# EAGLE design Connector Board rev2 (EAGLE 9.6.2)

## Sheet 1 of 3
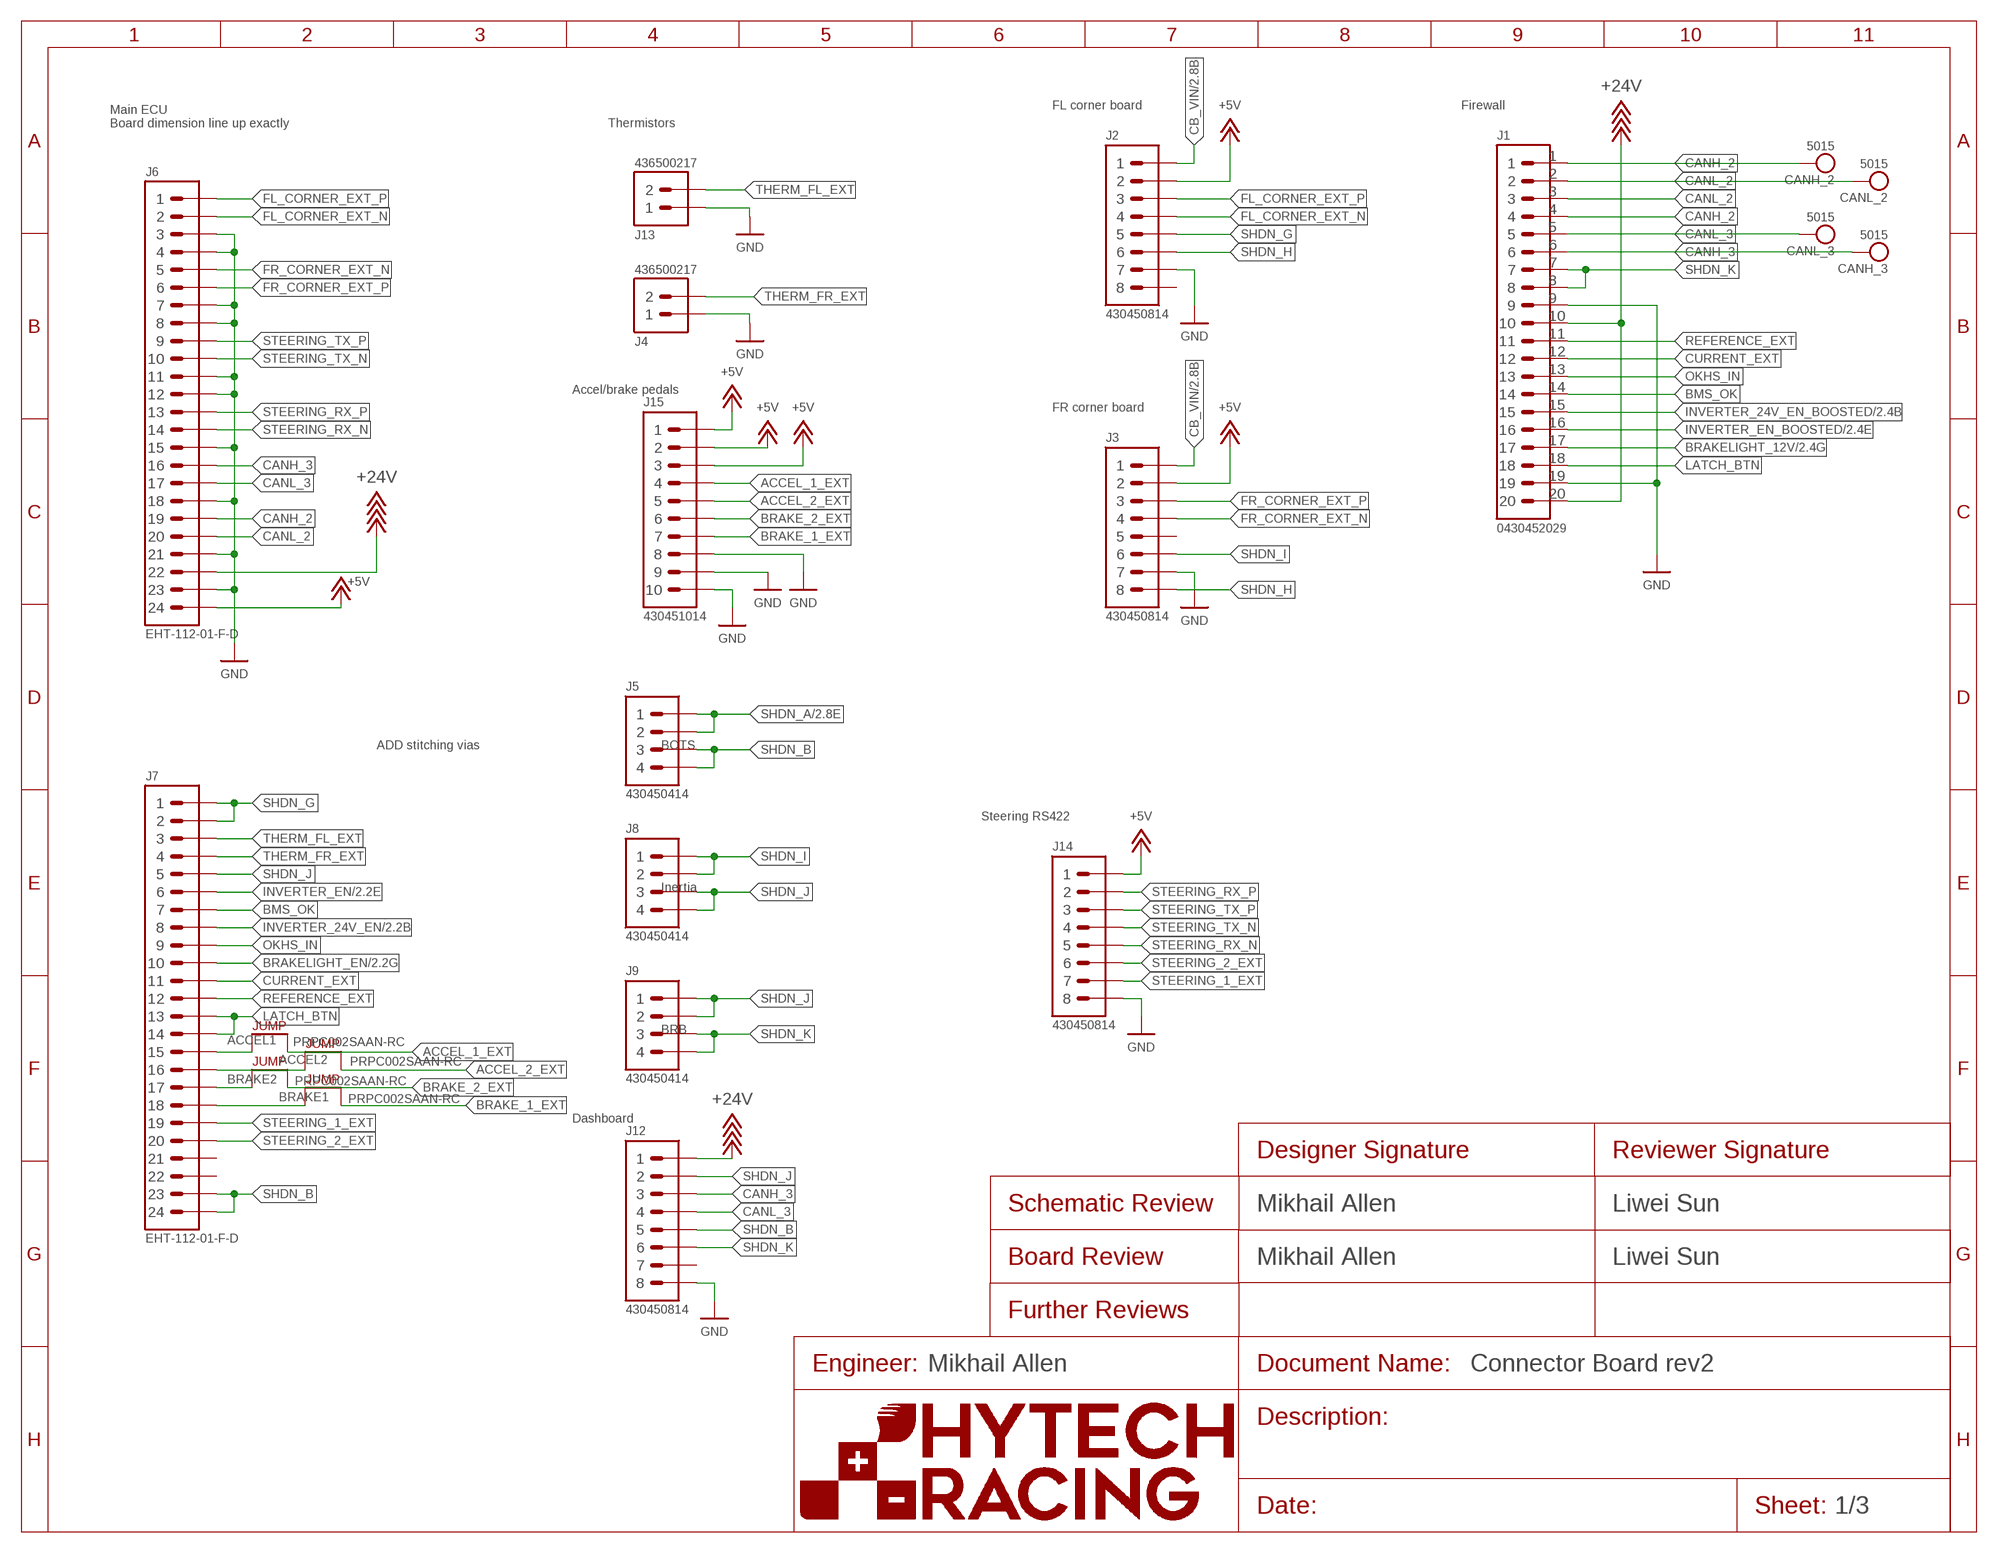
[diagram p0: schematic, sheet 1]
FRAME1 (FRAME): DESIGNER_BOARD: Mikhail Allen; DESIGNER_SCHEMATIC: Mikhail Allen; ENGINEER: Mikhail Allen; REVIEWER_BOARD: Liwei Sun; REVIEWER_SCHEMATIC: Liwei Sun

### Parts
ACCEL1  JUMPER__1X02  [1X02]
ACCEL2  JUMPER__1X02  [1X02]
BRAKE1  JUMPER__1X02  [1X02]
BRAKE2  JUMPER__1X02  [1X02]
CANH_2  TEST_POINT  [5015]
CANH_3  TEST_POINT  [5015]
CANL_2  TEST_POINT  [5015]
CANL_3  TEST_POINT  [5015]
J1  CONNECTOR-20_MF_T_V_  [MOLEX_MICROFIT_PTH_VERTICAL_20_DUAL]
J2  CONNECTOR-8_μF_T_V_BLACK  [MOLEX_MICROFIT_PTH_VERTICAL_08_DUAL]
J3  CONNECTOR-8_μF_T_V_BLACK  [MOLEX_MICROFIT_PTH_VERTICAL_08_DUAL]
J4  CONNECTOR-2_MF_T_V_  [MOLEX_MICROFIT_PTH_VERTICAL_02_SINGLE]
J5  CONNECTOR-4_μF_T_V_BLACK  [MOLEX_MICROFIT_PTH_VERTICAL_04_DUAL]
J6  CONNECTOR-24_CONNECTOR-24_  [EHT-112-01]
J7  CONNECTOR-24_CONNECTOR-24_  [EHT-112-01]
J8  CONNECTOR-4_μF_T_V_BLACK  [MOLEX_MICROFIT_PTH_VERTICAL_04_DUAL]
J9  CONNECTOR-4_μF_T_V_BLACK  [MOLEX_MICROFIT_PTH_VERTICAL_04_DUAL]
J12  CONNECTOR-8_μF_T_V_BLACK  [MOLEX_MICROFIT_PTH_VERTICAL_08_DUAL]
J13  CONNECTOR-2_MF_T_V_  [MOLEX_MICROFIT_PTH_VERTICAL_02_SINGLE]
J14  CONNECTOR-8_μF_T_V_BLACK  [MOLEX_MICROFIT_PTH_VERTICAL_08_DUAL]
J15  CONNECTOR-10_MF_T_V_  [MOLEX_MICROFIT_PTH_VERTICAL_10_DUAL]

### Nets
+5V: J2.2 J3.2 J6.24 J14.1 J15.1 J15.2 J15.3
+24V: J1.10 J1.20 J6.22 J12.1 ; also sheet 2
ACCEL_1_EXT: ACCEL1.2 J15.4
ACCEL_2_EXT: ACCEL2.2 J15.5
BMS_OK: J1.14 J7.7
BRAKE_1_EXT: BRAKE1.2 J15.7
BRAKE_2_EXT: BRAKE2.2 J15.6
BRAKELIGHT_12V: J1.17 ; also sheet 2
BRAKELIGHT_EN: J7.10 ; also sheet 2
CANH_2: CANH_2.1 J1.1 J1.4 J6.19
CANH_3: CANH_3.1 J1.6 J6.16 J12.3
CANL_2: CANL_2.1 J1.2 J1.3 J6.20
CANL_3: CANL_3.1 J1.5 J6.17 J12.4
CB_VIN: J2.1 J3.1 ; also sheet 2
CURRENT_EXT: J1.12 J7.11
FL_CORNER_EXT_N: J2.4 J6.2
FL_CORNER_EXT_P: J2.3 J6.1
FR_CORNER_EXT_N: J3.4 J6.5
FR_CORNER_EXT_P: J3.3 J6.6
GND: J1.9 J1.19 J2.7 J3.7 J4.1 J6.3 J6.4 J6.7 J6.8 J6.11 J6.12 J6.15 J6.18 J6.21 J6.23 J12.8 J13.1 J14.8 J15.8 J15.9 J15.10 ; also sheet 2
INVERTER_24V_EN: J7.8 ; also sheet 2
INVERTER_24V_EN_BOOSTED: J1.15 ; also sheet 2
INVERTER_EN: J7.6 ; also sheet 2
INVERTER_EN_BOOSTED: J1.16 ; also sheet 2
LATCH_BTN: J1.18 J7.13 J7.14
N$1: ACCEL1.1 J7.15
N$2: ACCEL2.1 J7.16
N$3: BRAKE2.1 J7.17
N$4: BRAKE1.1 J7.18
OKHS_IN: J1.13 J7.9
REFERENCE_EXT: J1.11 J7.12
SHDN_A: J5.1 J5.2 ; also sheet 2
SHDN_B: J5.3 J5.4 J7.23 J7.24 J12.5
SHDN_G: J2.5 J7.1 J7.2
SHDN_H: J2.6 J3.8
SHDN_I: J3.6 J8.1 J8.2
SHDN_J: J7.5 J8.3 J8.4 J9.1 J9.2 J12.2
SHDN_K: J1.7 J1.8 J9.3 J9.4 J12.6
STEERING_1_EXT: J7.19 J14.7
STEERING_2_EXT: J7.20 J14.6
STEERING_RX_N: J6.14 J14.5
STEERING_RX_P: J6.13 J14.2
STEERING_TX_N: J6.10 J14.4
STEERING_TX_P: J6.9 J14.3
THERM_FL_EXT: J7.3 J13.2
THERM_FR_EXT: J4.2 J7.4
Unconnected: J2.8 J3.5 J7.21 J7.22 J12.7

### Notes on the sheet
- FL corner board | Firewall
- Main ECU
  Board dimension line up exactly
- Thermistors
- Accel/brake pedals
- FR corner board
- ADD stitching vias | BOTS
- Steering RS422
- Inertia
- BRB
- Dashboard

## Sheet 2 of 3
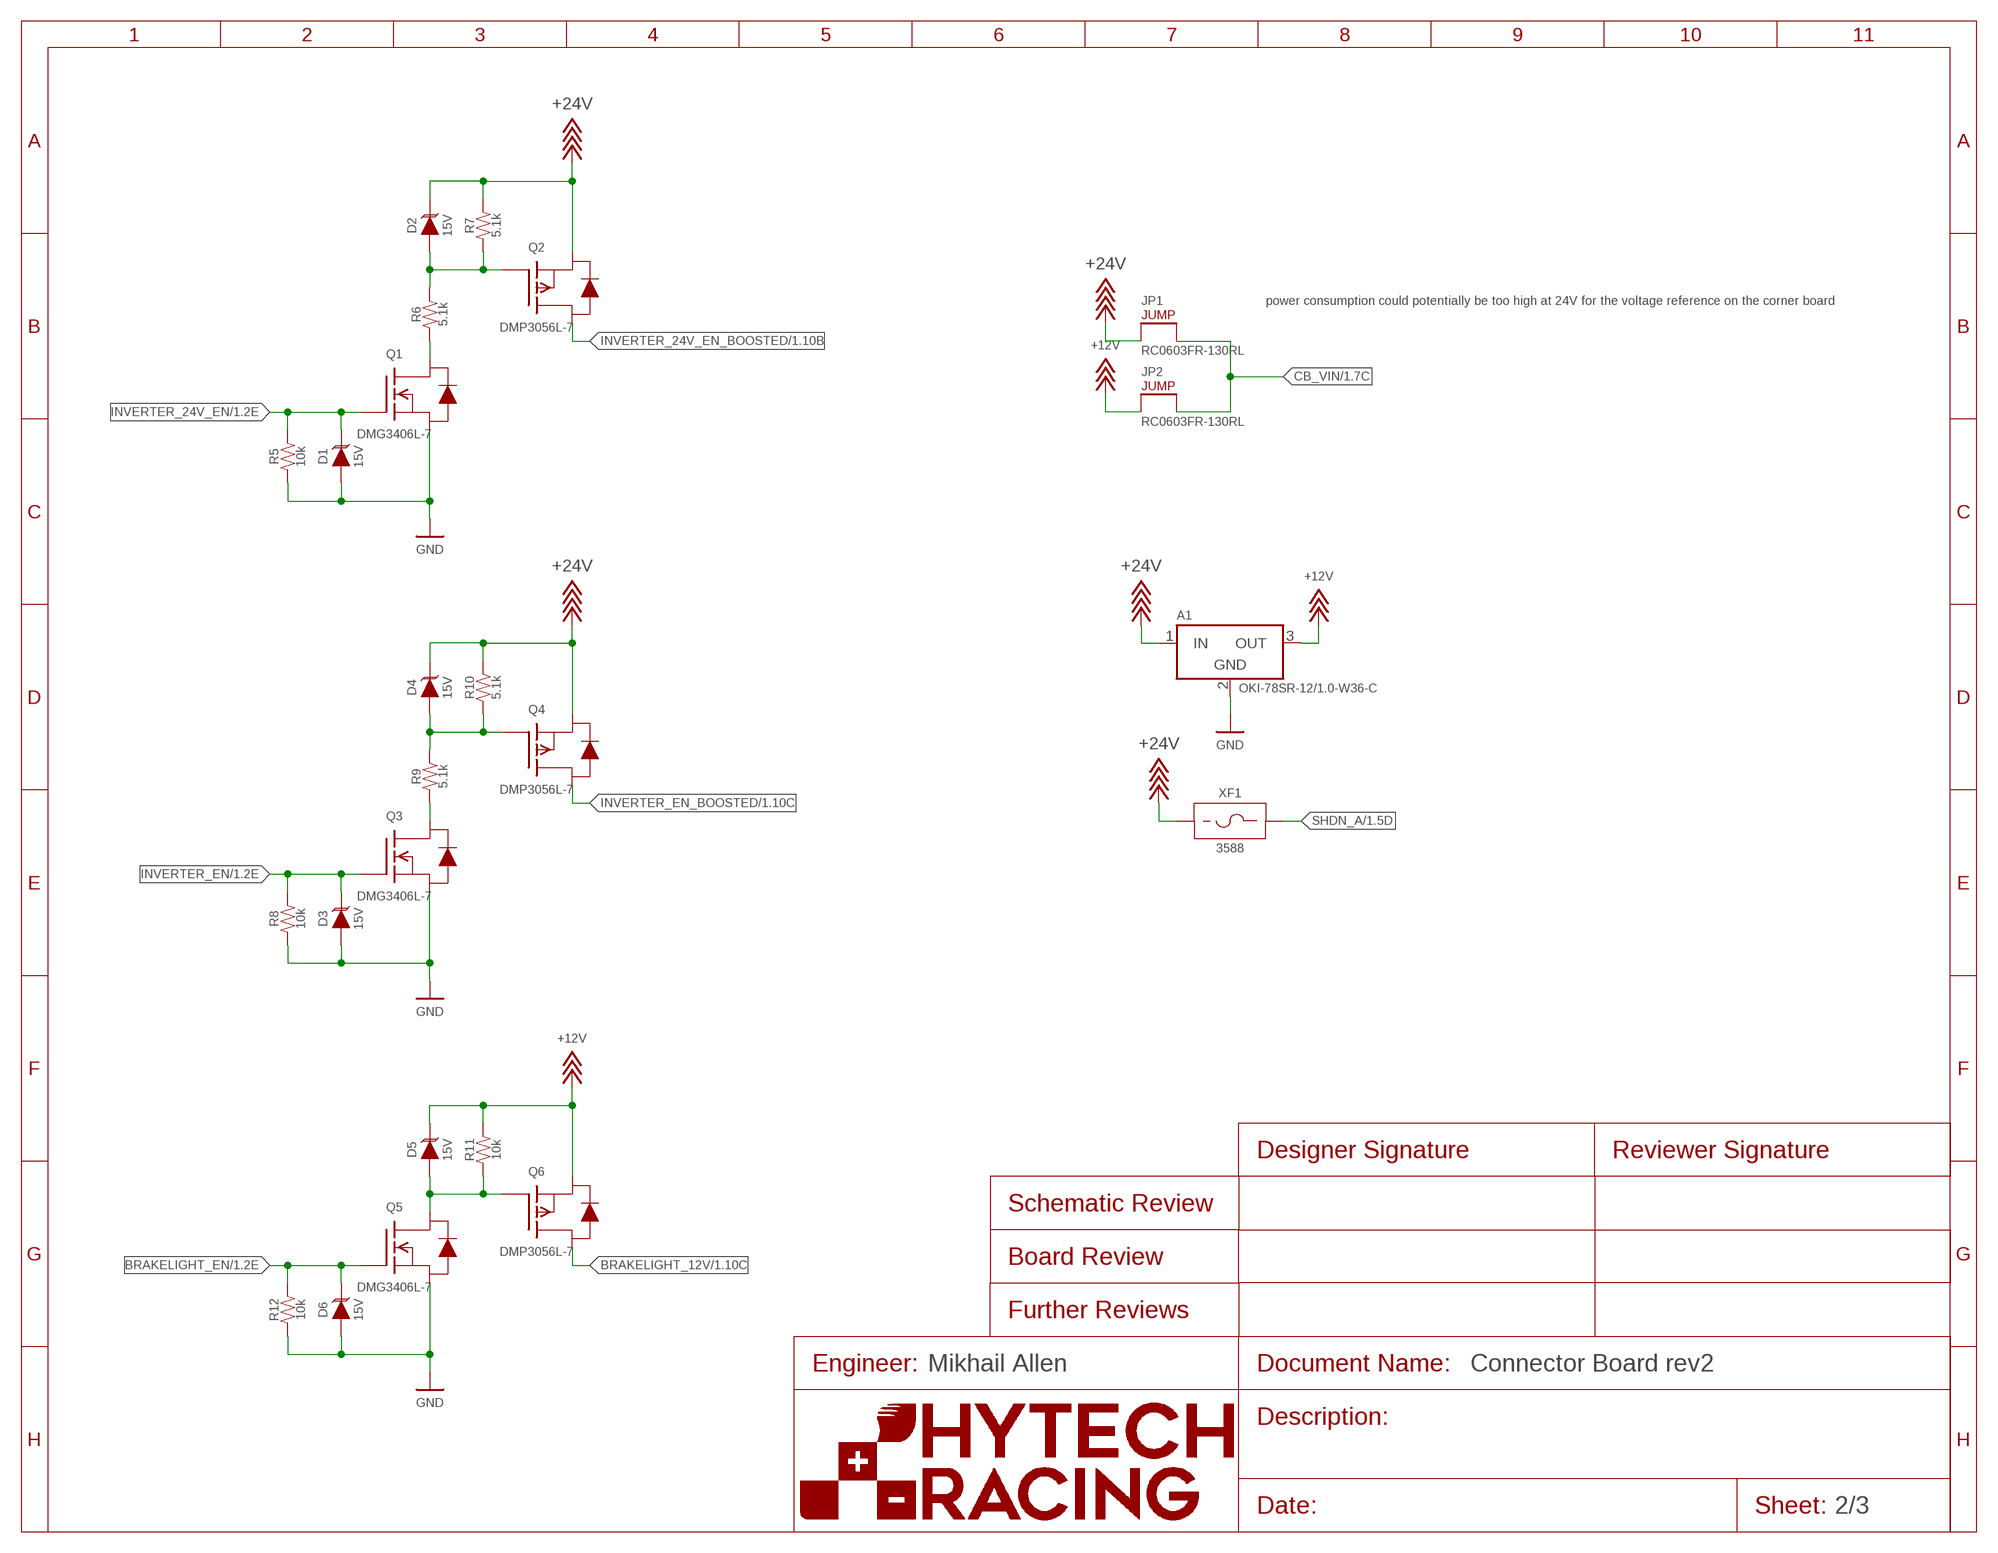
[diagram p1: schematic, sheet 2]
FRAME2 (FRAME): ENGINEER: Mikhail Allen

### Parts
A1  VOLTAGE_REGULATOR_MODULE_OKI-78SR_12V  [OKI-78SR]
D1  TVS__15V  [SOT-23]
D2  TVS__15V  [SOT-23]
D3  TVS__15V  [SOT-23]
D4  TVS__15V  [SOT-23]
D5  TVS__15V  [SOT-23]
D6  TVS__15V  [SOT-23]
JP1  JUMPER_0603_  [0603-RES]
JP2  JUMPER_0603_  [0603-RES]
Q1  TRANSISTOR_N_MOS__DMG3406L-7  [SOT-23]
Q2  TRANSISTOR_P_MOS_SOT-23_DMP3056L-7  [SOT-23]
Q3  TRANSISTOR_N_MOS__DMG3406L-7  [SOT-23]
Q4  TRANSISTOR_P_MOS_SOT-23_DMP3056L-7  [SOT-23]
Q5  TRANSISTOR_N_MOS__DMG3406L-7  [SOT-23]
Q6  TRANSISTOR_P_MOS_SOT-23_DMP3056L-7  [SOT-23]
R5  RESISTOR_0603_10K  [0603-RES]
R6  RESISTOR_0603_5.1K  [0603-RES]
R7  RESISTOR_0603_5.1K  [0603-RES]
R8  RESISTOR_0603_10K  [0603-RES]
R9  RESISTOR_0603_5.1K  [0603-RES]
R10  RESISTOR_0603_5.1K  [0603-RES]
R11  RESISTOR_0603_10K  [0603-RES]
R12  RESISTOR_0603_10K  [0603-RES]
XF1  FUSE_HOLDER_MINIBLADESMD  [3588]

### Nets
+12V: A1.3(OUT) D5.3(C) JP2.1 Q6.2(S) R11.2
+24V: A1.1(IN) D2.3(C) D4.3(C) JP1.1 Q2.2(S) Q4.2(S) R7.2 R10.2 XF1.1 XF1.2 ; also sheet 1
BRAKELIGHT_12V: Q6.3(D) ; also sheet 1
BRAKELIGHT_EN: D6.3(C) Q5.1(G) R12.2 ; also sheet 1
CB_VIN: JP1.2 JP2.2 ; also sheet 1
GND: A1.2(GND) D1.1(A) D3.1(A) D6.1(A) Q1.2(S) Q3.2(S) Q5.2(S) R5.1 R8.1 R12.1 ; also sheet 1
INVERTER_24V_EN: D1.3(C) Q1.1(G) R5.2 ; also sheet 1
INVERTER_24V_EN_BOOSTED: Q2.3(D) ; also sheet 1
INVERTER_EN: D3.3(C) Q3.1(G) R8.2 ; also sheet 1
INVERTER_EN_BOOSTED: Q4.3(D) ; also sheet 1
N$5: D2.1(A) Q2.1(G) R6.2 R7.1
N$7: Q1.3(D) R6.1
N$8: D4.1(A) Q4.1(G) R9.2 R10.1
N$9: Q3.3(D) R9.1
N$11: D5.1(A) Q5.3(D) Q6.1(G) R11.1
SHDN_A: XF1.3 XF1.4 ; also sheet 1

### Notes on the sheet
- power consumption could potentially be too high at 24V for the voltage reference on the corner board

## Sheet 3 of 3
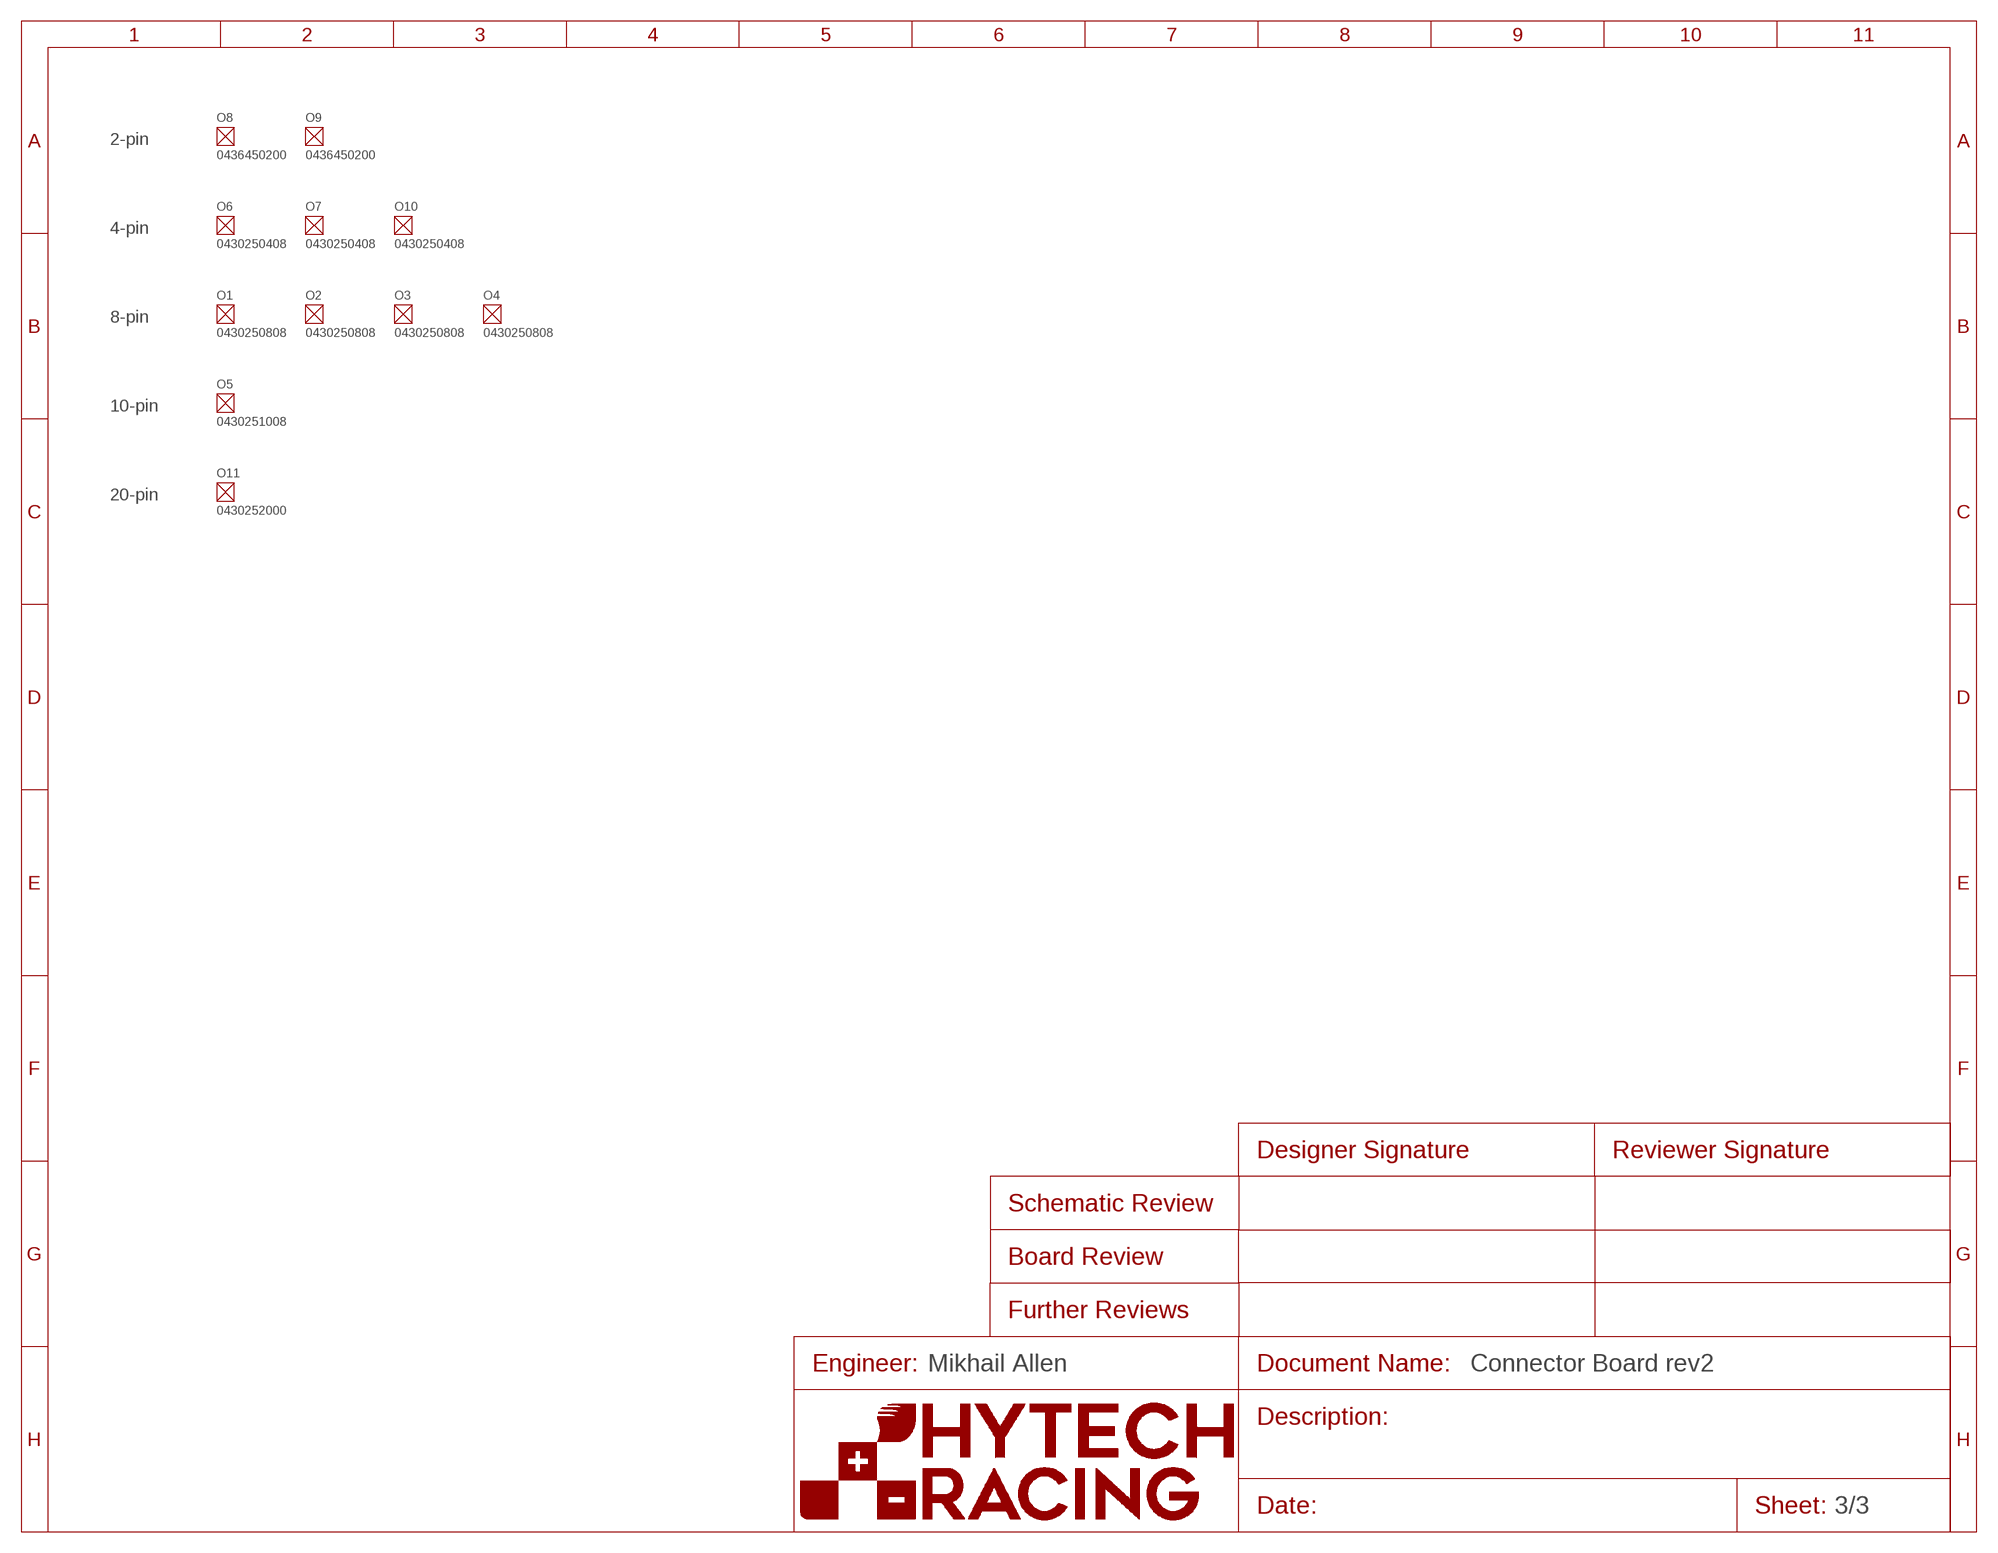
[diagram p2: schematic, sheet 3]
FRAME3 (FRAME): ENGINEER: Mikhail Allen
O1 (RECEPTACLE-8_MICROFIT): DKPN: WM13210-ND; MANUFACTURER: Molex; MOPN: 538-43025-0808; MPN: 0430250808
O2 (RECEPTACLE-8_MICROFIT): DKPN: WM13210-ND; MANUFACTURER: Molex; MOPN: 538-43025-0808; MPN: 0430250808
O3 (RECEPTACLE-8_MICROFIT): DKPN: WM13210-ND; MANUFACTURER: Molex; MOPN: 538-43025-0808; MPN: 0430250808
O4 (RECEPTACLE-8_MICROFIT): DKPN: WM13210-ND; MANUFACTURER: Molex; MOPN: 538-43025-0808; MPN: 0430250808
O5 (RECEPTACLE-10_MICROFIT): DKPN: WM16255-ND; MANUFACTURER: Molex; MOPN: 538-43025-1008; MPN: 0430251008
O6 (RECEPTACLE-4_MICROFIT): DKPN: WM11225-ND; MANUFACTURER: Molex; MOPN: 538-43025-0408; MPN: 0430250408
O7 (RECEPTACLE-4_MICROFIT): DKPN: WM11225-ND; MANUFACTURER: Molex; MOPN: 538-43025-0408; MPN: 0430250408
O8 (RECEPTACLE-2_MICROFIT): DKPN: WM1845-ND; MANUFACTURER: Molex; MOPN: 538-43645-0200; MPN: 0436450200
O9 (RECEPTACLE-2_MICROFIT): DKPN: WM1845-ND; MANUFACTURER: Molex; MOPN: 538-43645-0200; MPN: 0436450200
O10 (RECEPTACLE-4_MICROFIT): DKPN: WM11225-ND; MANUFACTURER: Molex; MOPN: 538-43025-0408; MPN: 0430250408
O11 (RECEPTACLE-20_MICROFIT): DKPN: WM2492-ND; MANUFACTURER: Molex; MOPN: 538-43025-2000; MPN: 0430252000

### Notes on the sheet
- 2-pin
- 4-pin
- 8-pin
- 10-pin
- 20-pin

## Library data of the parts
A1 = HyTechDevices:VOLTAGE_REGULATOR_MODULE_?_*: Voltage Regulator Modules OKI-78SR Datasheet <https://www.mouser.com/datasheet/2/281/oki-78sr-56393.pdf>; DKPN: 811-3293-ND; MANUFACTURER: Murata Power Solutions Inc.; MOPN: 580-OKI78SR12/1W36C; MPN: OKI-78SR-12/1.0-W36-C
ACCEL1 ACCEL2 BRAKE1 BRAKE2 = HyTechDevices:JUMPER_?_*: 2 Pin Connector; DKPN: S1011EC-02-ND; MANUFACTURER: Sullins Connector Solutions; MPN: PRPC002SAAN-RC
CANH_2 CANH_3 CANL_2 CANL_3 = HyTechDevices:TEST_POINT: Test Point for Probing; DKPN: 36-5015CT-ND; MANUFACTURER: Keystone Electronics; MOPN: 534-5015; MPN: 5015
D1-D6 = HyTechDevices:TVS_?_*: TVS Diode GSOT Datasheet <https://www.mouser.com/datasheet/2/427/gsot03-1767593.pdf>; DKPN: GSOT15-E3-08CT-ND; MANUFACTURER: Vishay General Semiconductor - Diodes Division; MOPN: 78-GSOT15-E3-08; MPN: GSOT15-E3-08; VOLTAGE: 15V
J1 = HyTechDevices:CONNECTOR-20_?_*: 20-pin connector Datasheet <https://www.molex.com/en-us/products/part-detail/430452029>; DKPN: WM10754-ND; MANUFACTURER: Molex; MOPN: 538-43045-2029; MPN: 0430452029
J2 J3 J12 J14 = HyTechDevices:CONNECTOR-8_?_*: 8 Pin Connector; DKPN: WM1798-ND; MANUFACTURER: Molex; MOPN: 538-43045-0814; MPN: 430450814
J4 J13 = HyTechDevices - Copy:CONNECTOR-2_?_*: 2 Pin Connector; MANUFACTURER: MOLEX; MPN: 436500217
J5 J8 J9 = HyTechDevices:CONNECTOR-4_?_*: 4 Pin Connector; DKPN: 2266-43045-0414-ND; MANUFACTURER: Molex; MOPN: 538-43045-0414; MPN: 430450414
J6 J7 = HyTechDevices:CONNECTOR-24_?_*: 24 pin ribbon connector header (EHT-112-01) Catalog <https://suddendocs.samtec.com/catalog_english/eht.pdf> Datasheet <http://suddendocs.samtec.com/prints/eht-d.pdf> Part <https://www.digikey.com/en/products/detail/samtec-inc/EHT-112-01-F-D/6693915>; DKPN: EHT-112-01-F-D-ND; MANUFACTURER: Samtec; MOPN: 200-EHT11201FD; MPN: EHT-112-01-F-D
J15 = HyTechDevices:CONNECTOR-10_?_*: 10 pin connector Datasheet <https://www.mouser.com/datasheet/2/276/0430451014_PCB_HEADERS-143158.pdf>; DKPN: WM1799-ND; MANUFACTURER: MOLEX; MOPN: 538-43045-1014; MPN: 430451014
JP1 JP2 = HyTechDevices:JUMPER_?_*: 2 Pin Connector; DKPN: 13-RC0603FR-130RLTR-ND; MANUFACTURER: YAGEO; MOPN: 603-RC0603FR-130RL; MPN: RC0603FR-130RL
Q1 Q3 Q5 = HyTechDevices:TRANSISTOR_N_MOS_?_*: N-MOSFET PMV15ENEA Datasheet <https://www.mouser.com/datasheet/2/916/PMV15ENEA-1604828.pdf> TK6P65W Datasheet <https://www.mouser.com/datasheet/2/408/TK6P65W_datasheet_en_20151225-1916290.pdf> SIR638ADP Datasheet <https://www.mouser.com/datasheet/2/427/sir638adp-1766131.pdf> DMG3406L Datasheet <https://www.diodes.com/assets/Datasheets/DMG3406L.pdf> STL2N80K5 <https://www.mouser.com/datasheet/2/389/dm00092662-1798082.pdf>; DKPN: DMG3406L-7DITR-ND; MANUFACTURER: Diodes Incorporated; MOPN: 621-DMG3406L-7; MPN: DMG3406L-7
Q2 Q4 Q6 = HyTechDevices:TRANSISTOR_P_MOS_?_*: P-MOSFET SI2369DS Datasheet <https://www.mouser.com/datasheet/2/427/si2369d-1764360.pdf> DMP3056L Datasheet <https://www.mouser.com/datasheet/2/115/DIOD_S_A0012915142_1-2543925.pdf>; DKPN: DMP3056L-7DITR-ND; MANUFACTURER: Diodes Incorporated; MOPN: 621-DMP3056L-7; MPN: DMP3056L-7
R5 R8 R11 R12 = HyTechDevices:RESISTOR_?_*: Resistor PWR163 Series <https://www.mouser.com/datasheet/2/54/pwr163-777985.pdf> AC Series <https://www.mouser.com/datasheet/2/447/Yageo_PYu_AC_51_RoHS_L_7_1714230-1874691.pdf> PU Series <https://www.mouser.com/datasheet/2/447/PYu-PU_51_RoHS_L_6-1504619.pdf> UCR Series <https://fscdn.rohm.com/en/products/databook/datasheet/passive/resistor/chip_resistor/ucr-e.pdf> ERA Series <https://www.mouser.com/datasheet/2/315/AOA0000C307-1149632.pdf> PWR263 Series <https://www.mouser.com/datasheet/2/54/pwr263s_35-778069.pdf> KTR Series <https://www.mouser.com/datasheet/2/348/ROHM_S_A0011075115_1-2563276.pdf> RC Series <https://www.mouser.com/datasheet/2/447/Yageo_03_18_2021_PYu_RC_Group_51_RoHS_L_11-2199992.pdf> ERJ Low Resistance Series <https://www.mouser.com/datasheet/2/315/AOA0000C313-1141758.pdf> ERJ PB3, PB6 Series <https://www.mouser.com/datasheet/2/315/AOA0000C328-1530132.pdf> ERJ UP3, UP6, UP8 Series <https://www.mouser.com/datasheet/2/315/Panasonic_Resistors_Thick_Film_Anti_Sulf_Anti_Surg-1825099.pdf> ERJ PA2, P03, PA3, P06, P08, P14 Series <https://www.mouser.com/datasheet/2/315/AOA0000C331-1141874.pdf> B20 Series <https://www.ohmite.com/assets/docs/res_200.pdf?r=false> TE Connectivity/Holsworthy RN73 Series <https://www.mouser.com/datasheet/2/418/4/NG_DS_1773270_M-604713.pdf> Vishay Dale D/CRCW e3 <https://www.mouser.com/datasheet/2/427/dcrcwe3-1762152.pdf> Ohmite B20 <https://www.ohmite.com/assets/docs/res_200.pdf?r=false>; DKPN: P10KBDCT-ND; MANUFACTURER: Panasonic Electronic Components; MOPN: 667-ERA-3ARB103V; MPN: ERA-3ARB103V; POWER: 0.1W; RESISTANCE: 10k; TOLERANCE: 0.1%; VOLTAGE_CONTINUOUS: 31.62V; VOLTAGE_MAX: 75V
R6 R7 R9 R10 = HyTechDevices:RESISTOR_?_*: Resistor PWR163 Series <https://www.mouser.com/datasheet/2/54/pwr163-777985.pdf> AC Series <https://www.mouser.com/datasheet/2/447/Yageo_PYu_AC_51_RoHS_L_7_1714230-1874691.pdf> PU Series <https://www.mouser.com/datasheet/2/447/PYu-PU_51_RoHS_L_6-1504619.pdf> UCR Series <https://fscdn.rohm.com/en/products/databook/datasheet/passive/resistor/chip_resistor/ucr-e.pdf> ERA Series <https://www.mouser.com/datasheet/2/315/AOA0000C307-1149632.pdf> PWR263 Series <https://www.mouser.com/datasheet/2/54/pwr263s_35-778069.pdf> KTR Series <https://www.mouser.com/datasheet/2/348/ROHM_S_A0011075115_1-2563276.pdf> RC Series <https://www.mouser.com/datasheet/2/447/Yageo_03_18_2021_PYu_RC_Group_51_RoHS_L_11-2199992.pdf> ERJ Low Resistance Series <https://www.mouser.com/datasheet/2/315/AOA0000C313-1141758.pdf> ERJ PB3, PB6 Series <https://www.mouser.com/datasheet/2/315/AOA0000C328-1530132.pdf> ERJ UP3, UP6, UP8 Series <https://www.mouser.com/datasheet/2/315/Panasonic_Resistors_Thick_Film_Anti_Sulf_Anti_Surg-1825099.pdf> ERJ PA2, P03, PA3, P06, P08, P14 Series <https://www.mouser.com/datasheet/2/315/AOA0000C331-1141874.pdf> B20 Series <https://www.ohmite.com/assets/docs/res_200.pdf?r=false> TE Connectivity/Holsworthy RN73 Series <https://www.mouser.com/datasheet/2/418/4/NG_DS_1773270_M-604713.pdf> Vishay Dale D/CRCW e3 <https://www.mouser.com/datasheet/2/427/dcrcwe3-1762152.pdf> Ohmite B20 <https://www.ohmite.com/assets/docs/res_200.pdf?r=false>; DKPN: 311-5.10KHRTR-ND; MANUFACTURER: Yageo; MOPN: 603-RC0603FR-075K1L; MPN: RC0603FR-075K1L; POWER: 0.1W; RESISTANCE: 5.1k; TOLERANCE: 1%; VOLTAGE_CONTINUOUS: 22.58V; VOLTAGE_MAX: 75V
XF1 = HyTechDevices:FUSE_HOLDER_*: Fuse Holder All PNs for the holder; if Miniblade Fuses <https://www.littelfuse.com/media?resourcetype=datasheets&itemid=0f5f58cb-559e-494b-8d53-723f30445ae5&filename=littelfuse-mini-datasheet> needed, order separately. Mini-Blade PTH <https://www.mouser.com/datasheet/2/215/3568-742601.pdf> Mini-Blade SMD <https://www.mouser.com/datasheet/2/215/588-744913.pdf> Littelfuse 122 Fuse Holder and Fuse Fuse <https://www.littelfuse.com/~/media/electronics/datasheets/fuses/littelfuse_fuse_508_datasheet.pdf.pdf> Fuse Holder <https://www.littelfuse.com/~/media/electronics/datasheets/fuse_clips/littelfuse_fuse_clip_102_122_datasheet.pdf.pdf>; DKPN: 36-3588-ND; FUSE_TYPE: MINI 297; MANUFACTURER: Keystone Electronics; MOPN: 534-3588; MPN: 3588

## Board
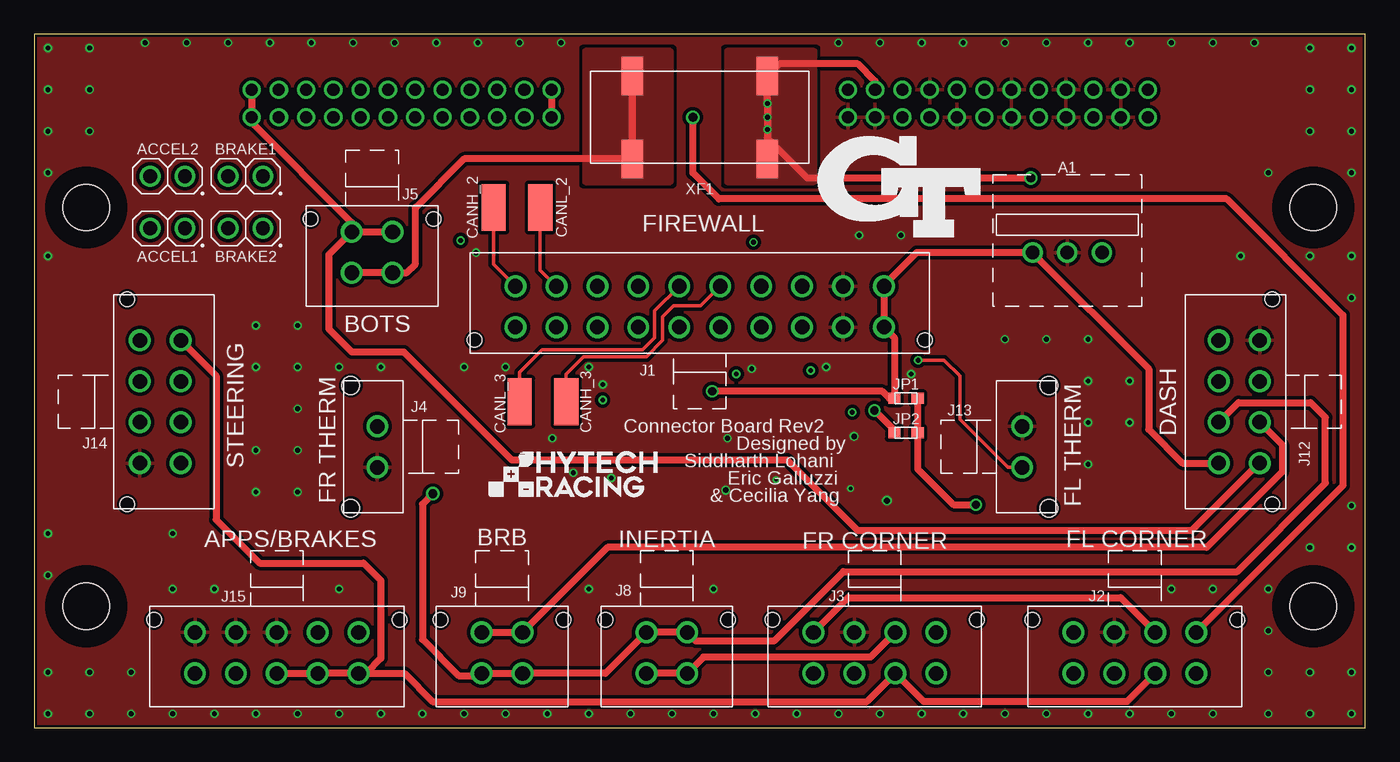
[diagram p3: board, top side]
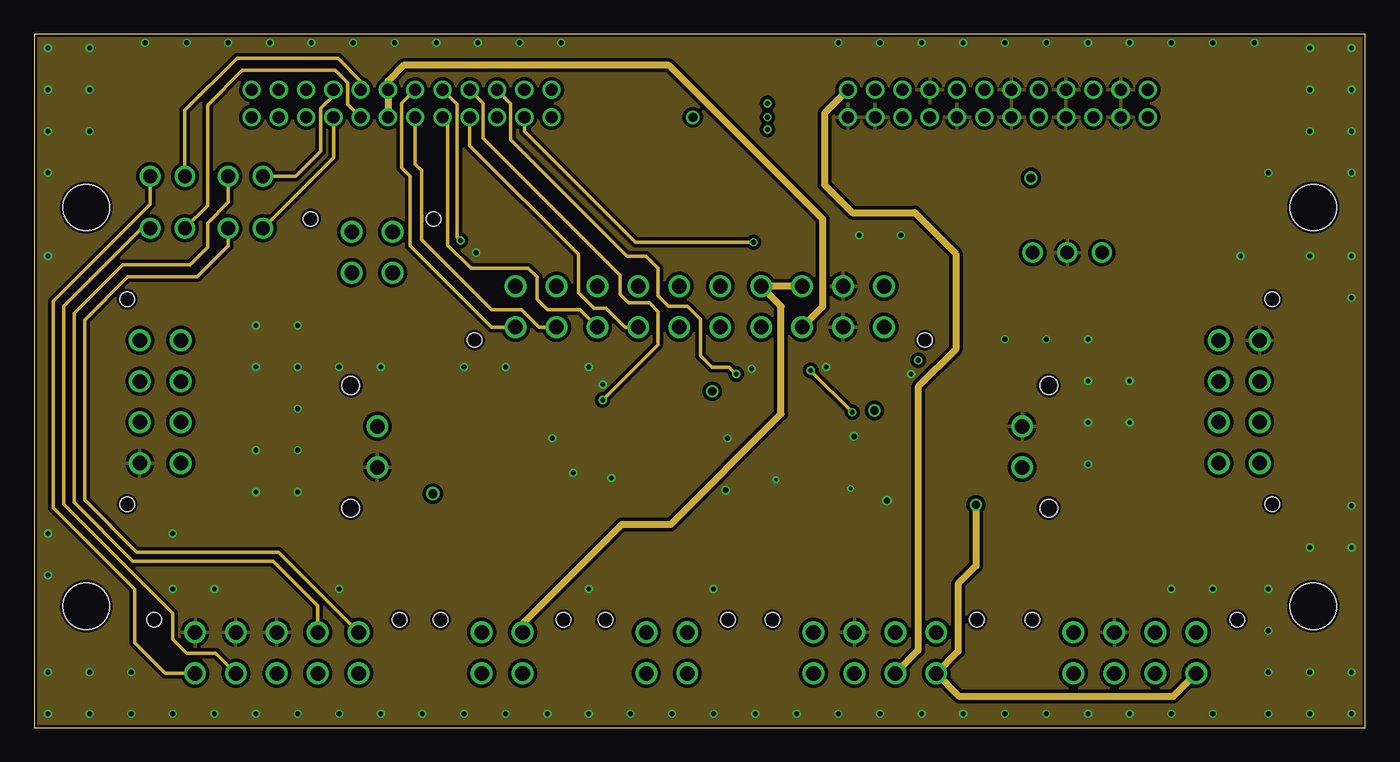
[diagram p4: board, inner layer Route2]
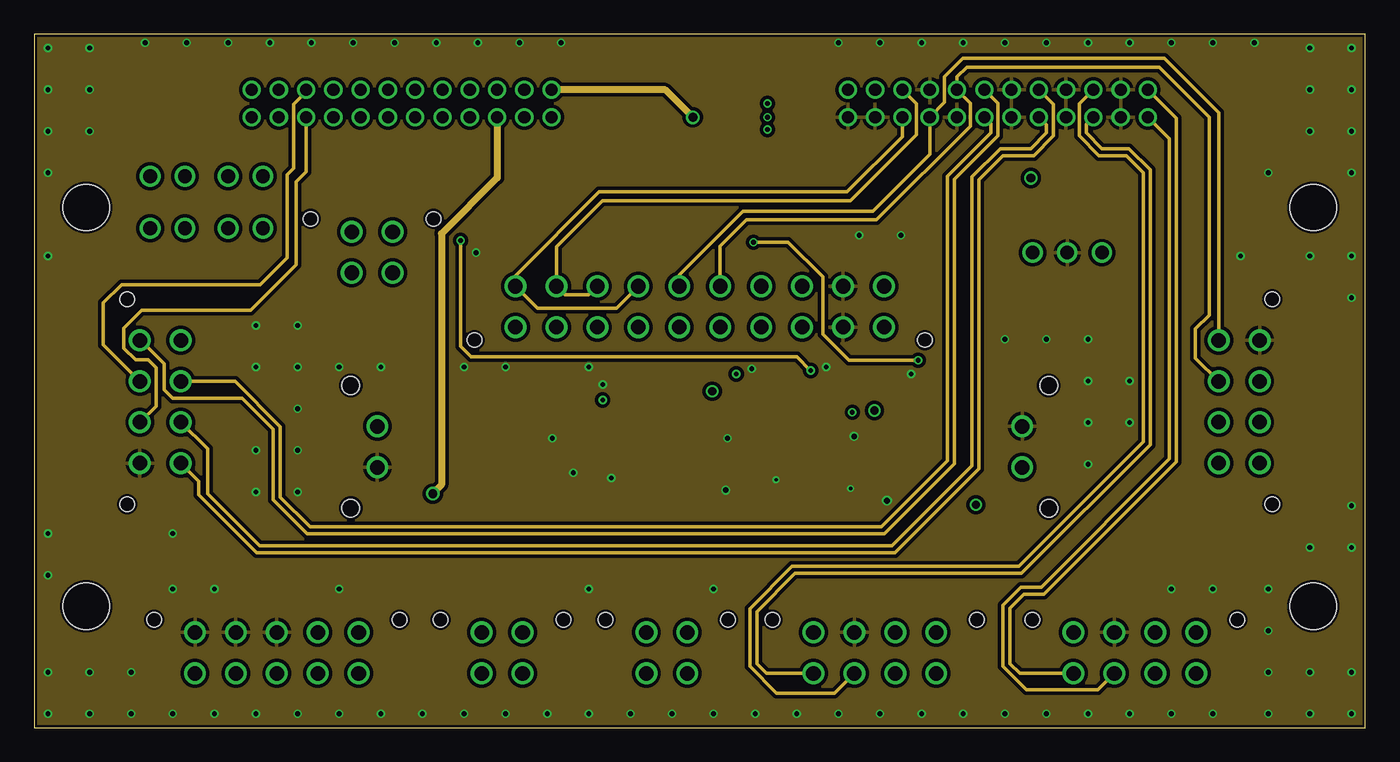
[diagram p5: board, inner layer Route15]
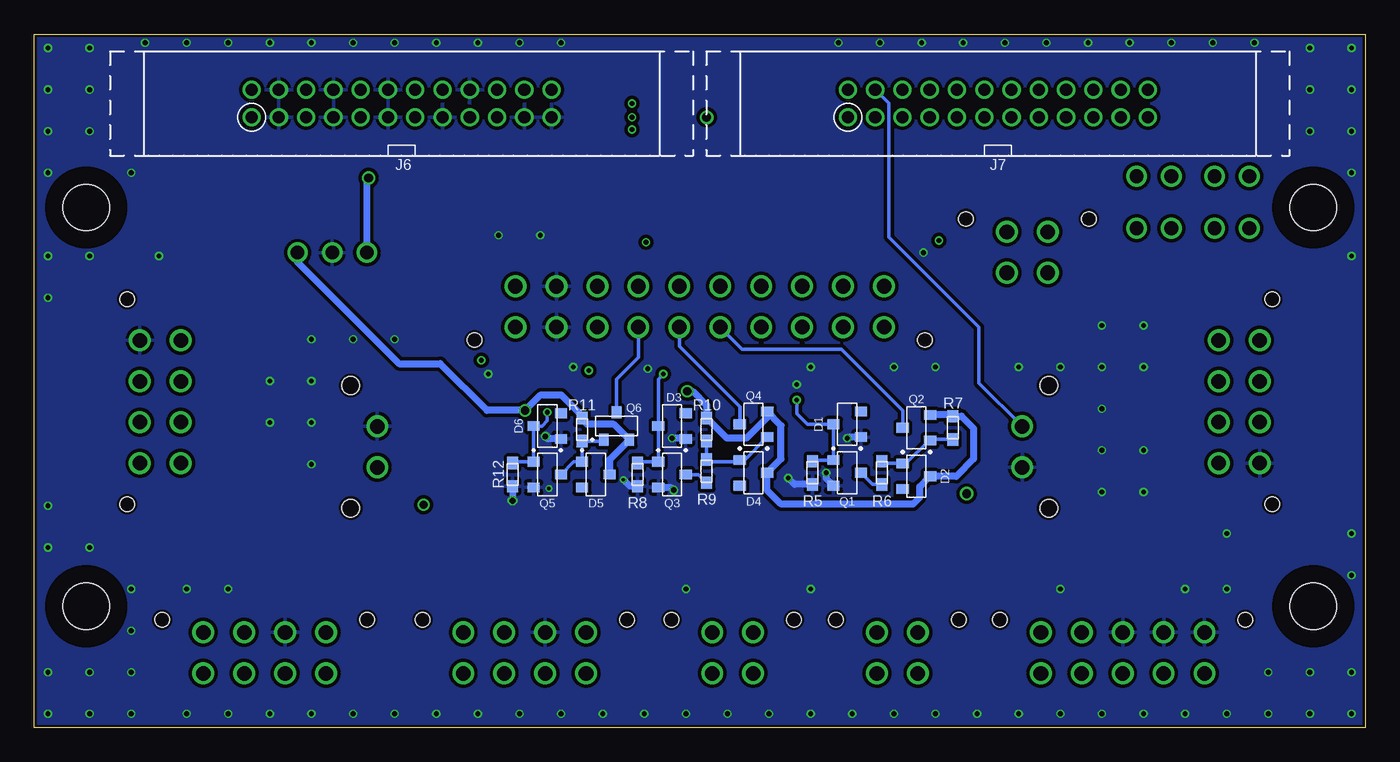
[diagram p6: board, bottom side, seen from below]

Size 97.54 x 50.8 mm. Coordinates in mm from the lower left corner, seen from the top.
Outline: 0,0 97.54,0 97.54,50.8 0,50.8 0,0
Copper layers (1+2*15+16): Top 0.035mm / dielectric 0.2mm / Route2 0.0175mm / dielectric 1.065mm / Route15 0.0175mm / dielectric 0.2mm / Bottom 0.035mm
Design rules "JLCPCB (4 Layer) *": minimum track width 5mil, minimum drill 0.2mm, track to track 10mil, track to pad 5mil, pad to pad 5mil, via to via 20mil, smd to smd 5mil, copper to edge 0.2mm, drill to drill 21mil, minimum pad ring 6mil, minimum via ring 5mil, stop-mask expansion 2mil, vias tented up to drill 30mil, thermal gap 10mil

### Footprints (pad centres in the part's own frame; a part is rotated, then mirrored left to right if it is on the bottom)
OKI-78SR = drill 0.991: 1 -2.54,0; 2 0,0; 3 2.54,0
1X02 = drill 1.016: 1 -1.27,0; 2 1.27,0
5015 = smd 3.429 x 1.778: 1 0,0
SOT-23 = smd 0.711 x 0.889: 1 -0.94,-1.003; 2 0.94,-1.003; 3 0,1.003
MOLEX_MICROFIT_PTH_VERTICAL_20_DUAL = drill 1.067: 1 13.5,-3; 2 10.5,-3; 3 7.5,-3; 4 4.5,-3; 5 1.5,-3; 6 -1.5,-3; 7 -4.5,-3; 8 -7.5,-3; 9 -10.5,-3; 10 -13.5,-3; 11 13.5,0; 12 10.5,0; 13 7.5,0; 14 4.5,0; 15 1.5,0; 16 -1.5,0; 17 -4.5,0; 18 -7.5,0; 19 -10.5,0; 20 -13.5,0 | hole 1.067: 16.5,0.94; -16.5,0.94
MOLEX_MICROFIT_PTH_VERTICAL_08_DUAL = drill 1.067: 1 4.496,-2.997; 2 1.499,-2.997; 3 -1.499,-2.997; 4 -4.496,-2.997; 5 4.496,0; 6 1.499,0; 7 -1.499,0; 8 -4.496,0 | hole 1.067: 7.493,0.94; -7.493,0.94
MOLEX_MICROFIT_PTH_VERTICAL_02_SINGLE = drill 1.067: 1 1.499,0; 2 -1.499,0 | hole 1.321: 4.496,-1.956; -4.496,-1.956
MOLEX_MICROFIT_PTH_VERTICAL_04_DUAL = drill 1.067: 1 1.499,-2.997; 2 -1.499,-2.997; 3 1.499,0; 4 -1.499,0 | hole 1.067: 4.496,0.94; -4.496,0.94
EHT-112-01 = drill 0.889: 1 -10.994,-0.999; 2 -10.994,0.999; 3 -8.995,-0.999; 4 -8.995,0.999; 5 -6.996,-0.999; 6 -6.996,0.999; 7 -4.997,-0.999; 8 -4.997,0.999; 9 -2.998,-0.999; 10 -2.998,0.999; 11 -0.999,-0.999; 12 -0.999,0.999; 13 0.999,-0.999; 14 0.999,0.999; 15 2.998,-0.999; 16 2.998,0.999; 17 4.997,-0.999; 18 4.997,0.999; 19 6.996,-0.999; 20 6.996,0.999; 21 8.995,-0.999; 22 8.995,0.999; 23 10.994,-0.999; 24 10.994,0.999
MOLEX_MICROFIT_PTH_VERTICAL_10_DUAL = drill 1.067: 1 5.994,-2.997; 2 2.997,-2.997; 3 0,-2.997; 4 -2.997,-2.997; 5 -5.994,-2.997; 6 5.994,0; 7 2.997,0; 8 0,0; 9 -2.997,0; 10 -5.994,0 | hole 1.067: 8.992,0.94; -8.992,0.94
0603-RES = smd 0.9 x 0.8: 1 -0.85,0; 2 0.85,0
MOUNTING_M3 = hole 3.4: 0,0
3588 = smd 1.575 x 2.819: 1 -4.953,3.035; 2 -4.953,-3.035; 3 4.953,-3.035; 4 4.953,3.035

### Placement (x,y rotation side)
A1  75.69,34.8 0 top
ACCEL1  9.78,36.58 180 top
ACCEL2  9.78,40.39 180 top
BRAKE1  15.49,40.39 180 top
BRAKE2  15.49,36.58 180 top
CANH_2  33.66,38.1 90 top
CANH_3  38.99,23.88 90 top
CANL_2  37.08,38.1 90 top
CANL_3  35.56,23.88 90 top
D1  37.97,22.23 90 bottom
D2  32.89,18.41 270 bottom
D3  50.8,22.1 90 bottom
D4  44.83,18.67 270 bottom
D5  56.39,18.54 270 bottom
D6  59.94,22.1 90 bottom
J1  48.77,29.34 180 top
J2  80.64,6.99 0 top
J3  61.59,6.99 0 top
J4  25.15,20.57 270 top
J5  24.77,36.32 0 top
J6  70.61,45.72 0 bottom
J7  26.92,45.72 0 bottom
J8  46.35,6.99 0 top
J9  34.29,6.99 0 top
J12  89.79,23.88 270 top
J13  72.39,20.57 90 top
J14  7.75,23.88 90 top
J15  17.78,6.99 0 top
JP1  63.88,24.13 0 top
JP2  63.88,21.59 0 top
Q1  37.97,18.67 270 bottom
Q2  32.89,21.97 90 bottom
Q3  50.8,18.54 270 bottom
Q4  44.83,22.23 90 bottom
Q5  59.94,18.54 270 bottom
Q6  54.86,22.1 0 bottom
R5  40.51,18.67 90 bottom
R6  35.43,18.67 90 bottom
R7  30.23,21.97 90 bottom
R8  53.34,18.54 90 bottom
R9  48.26,18.8 90 bottom
R10  48.26,21.84 90 bottom
R11  57.4,21.84 90 bottom
R12  62.48,18.54 90 bottom
U$4  [MOUNTING_M3]  3.81,38.1 0 top
U$5  [MOUNTING_M3]  3.81,8.89 0 top
U$6  [MOUNTING_M3]  93.73,8.89 0 top
U$7  [MOUNTING_M3]  93.73,38.1 0 top
U$11  [LOGO_GT_MEDIUM]  63.37,39.62 0 top
U$14  [LOGO_HYTECH_SMALL]  33.27,16.89 0 top
XF1  48.77,44.7 180 top

### Tracks (layer width: path | path; a pad name or v marks a point on that pad's centre or on a via)
+5V
  Top 0.508: J15.3 J15.2 J15.1 24.31,3.99 | 24.31,3.99 27.13,3.99 29.21,1.91 61.01,1.91 J3.2 65.18,1.91 80.06,1.91 J2.2 | J14.1 13.34,25.78 13.34,15.24 16.51,12.06 24.13,12.06 25.4,10.79 25.4,5.08 24.31,3.99
  Route2 0.508: J6.24 57.91,45.01 57.91,39.75 59.94,37.72 64.52,37.72 67.53,34.71 67.53,27.72 64.77,24.96 64.77,5.66 J3.2
+12V  (via drill 0.6)
  Top 0.508: JP2.1 63.03,21.78 v61.57,23.24
  Bottom 0.254: R11.2 57.4,22.61
  Bottom 0.508: D5.3 55.38,19.63 Q6.2 55.05,22.23 57.02,22.23 57.4,22.61 | R11.2 57.4,22.86 58.93,24.38 60.42,24.38 v61.57,23.24 64.36,23.24 67.79,26.67 70.8,26.67 78.23,34.1 A1.3
+24V  (via drill 0.35, 0.6, 0.65)
  Top 0.508: v53.72,43.81 v53.72,44.7 v53.72,45.72 XF1.2 54.61,48.63 60.34,48.63 61.62,47.35 J6.22 | v53.72,43.81 53.72,43.18 56.64,40.26 v73.03,40.26 | v53.72,43.81 XF1.1 | J12.1 84.12,19.38 81.66,21.84 81.66,26.29 A1.1 64.64,34.8 62.27,32.42 J1.10 J1.20 63.03,28.57 JP1.1 62.65,24.13 62.14,24.64 v49.69,24.64
  Bottom 0.508: A1.1 73.15,40.13 v73.03,40.26 | v49.69,24.64 49.28,24.64 48.26,23.62 R10.2 46.77,21.21 45.34,21.21 43.83,22.72 Q4.2 42.8,22.14 42.8,19.7 D4.3 43.83,17.41 42.8,16.38 33.15,16.38 32.64,16.89 32.64,17.67 D2.3 29.97,18.41 28.7,19.68 28.7,21.93 29.59,22.82 R7.2 30.32,22.91 Q2.2
  pour Top (no thermals): 50.8,49.53 50.8,40.01 57.15,40.01 57.15,49.53
ACCEL_1_EXT
  Route2 0.254: J15.4 13.31,5.46 11.18,5.46 10.16,6.48 10.16,8.38 2.16,16.38 2.16,30.86 7.87,36.58 ACCEL1.2
ACCEL_2_EXT
  Route2 0.254: J15.5 9.6,3.99 7.37,6.22 7.37,10.16 1.4,16.13 1.4,31.24 8.51,38.35 ACCEL2.2
BMS_OK
  Route2 0.254: J7.7 31.92,42.63 39.88,34.67 39.88,31.88 41.02,30.73 41.91,30.73 43.31,29.34 J1.14
BRAKE_1_EXT
  Route2 0.254: J15.7 20.78,8.94 17.53,12.19 7.24,12.19 2.92,16.51 2.92,30.35 6.48,33.91 11.43,33.91 12.7,35.18 12.7,36.96 14.22,38.48 BRAKE1.2
BRAKE_2_EXT
  Route2 0.254: J15.6 17.9,12.86 7.52,12.86 3.7,16.68 3.7,29.86 6.86,33.02 11.94,33.02 14.22,35.31 BRAKE2.2
BRAKELIGHT_12V
  Bottom 0.254: Q6.3 54.86,25.53 53.27,27.12 J1.17
BRAKELIGHT_EN  (via drill 0.35)
  Route2 0.254: J7.10 30.99,45.65 30.99,35.94 v31.24,35.69 | v59.94,23.11 v56.9,26.16
  Route15 0.254: v31.24,35.69 31.24,27.94 32,27.18 55.88,27.18 v56.9,26.16
  Bottom 0.254: v59.94,23.11 59.94,22.48 60.33,22.1 D6.3 Q5.1 62.39,19.48 R12.2
CANH_2
  Top 0.254: J1.1 33.66,33.95 CANH_2.1
  Route15 0.254: J6.19 63.62,43.3 59.56,39.24 41.4,39.24 35.27,33.11 J1.1 36.87,30.73 42.66,30.73 J1.4
CANH_3
  Top 0.254: CANH_3.1 38.99,25.91 40.26,27.18 44.85,27.18 46.05,28.37 46.05,30.12 46.83,30.9 48.83,30.9 J1.6
  Route15 0.254: J1.6 50.27,35.28 52.2,37.21 61.72,37.21 68.58,44.07 68.58,45.72 67.61,46.69 J6.16 67.61,47.67 68.33,48.39 82.42,48.39 86.11,44.7 86.11,30.23 85.09,29.21 85.09,27.08 J12.3
CANL_2
  Top 0.254: CANL_2.1 37.08,33.52 J1.2
  Route15 0.254: J6.20 64.64,45.69 64.64,43.43 59.82,38.61 41.66,38.61 38.27,35.22 J1.2 38.9,31.7 40.63,31.7 J1.3
CANL_3
  Top 0.254: CANL_3.1 35.56,26.04 37.21,27.69 44.58,27.69 45.47,28.57 45.47,30.54 J1.5
  Route15 0.254: J1.5 47.27,33.17 51.94,37.85 61.47,37.85 65.61,41.99 J6.17 66.69,45.8 66.69,47.67 68.04,49.02 82.8,49.02 86.79,45.03 J12.4
CB_VIN  (via drill 0.6)
  Top 0.508: JP1.2 JP2.2 64.73,18.96 67.35,16.34 v69,16.34
  Route2 0.508: J2.1 83.44,2.29 67.79,2.29 J3.1 67.69,5.59 67.69,10.54 69,11.86 v69,16.34
CURRENT_EXT
  Route2 0.254: J7.11 27.92,41.27 28.38,40.81 28.38,35.75 33.53,30.61 35.73,30.61 37,29.34 J1.12
FL_CORNER_EXT_N
  Route15 0.254: J6.2 83.69,44.63 83.69,19.48 74,9.78 72.52,9.78 71.5,8.76 71.5,4.7 72.21,3.99 J2.4
FL_CORNER_EXT_P
  Route15 0.254: J6.1 83.19,43.14 83.19,19.68 73.79,10.29 72.31,10.29 70.99,8.97 70.99,4.49 72.69,2.79 77.95,2.79 J2.3
FR_CORNER_EXT_N
  Route15 0.254: J6.5 77.09,44.2 77.09,43.56 78.23,42.42 80.22,42.42 81.79,40.85 81.79,20.75 72.35,11.3 55.75,11.3 52.96,8.51 52.96,4.7 53.67,3.99 J3.4
FR_CORNER_EXT_P
  Route15 0.254: J6.6 76.58,45.69 76.58,43.35 78.02,41.91 80.01,41.91 81.28,40.64 81.28,20.95 72.14,11.81 55.54,11.81 52.45,8.72 52.45,4.49 54.4,2.54 58.65,2.54 J3.3
GND  (via drill 0.25, 0.35, 0.4, 0.45)
  Bottom 0.508: R12.1 v62.48,16.64 | D6.1 59.89,21.16 v60.07,21.34 | R8.1 53.89,17.69 v54.36,18.16 | Q3.2 50.88,17.6 v50.67,17.4 | D3.1 49.85,21.21 v50.8,21.21 | R5.1 41.82,17.82 v42.29,18.29 | Q1.2 39.5,18.25 v39.5,18.67 | D1.1 37.9,21.29 v37.97,21.21
  other vias: 59.82,17.53 1.02,49.78 4.06,49.78 4.06,46.74 1.02,46.74 1.02,43.69 4.06,43.69 1.02,40.64 1.02,34.54 10.16,1.02 1.02,14.22 1.02,11.18 1.02,4.06 1.02,1.02 4.06,1.02 4.06,4.06 7.11,4.06 7.11,1.02 13.21,1.02 16.26,1.02 19.3,1.02 22.35,1.02 25.4,1.02 28.45,1.02 31.5,1.02 34.54,1.02 37.59,1.02 40.64,1.02 43.69,1.02 46.74,1.02 49.78,1.02 52.83,1.02 55.88,1.02 58.93,1.02 61.98,1.02 65.02,1.02 68.07,1.02 71.12,1.02 74.17,1.02 77.22,1.02 80.26,1.02 83.31,1.02 86.36,1.02 90.42,1.02 93.47,1.02 96.52,1.02 96.52,4.06 93.47,4.06 90.42,4.06 90.42,7.11 90.42,10.16 96.52,13.21 93.47,13.21 96.52,16.26 22.35,10.16 13.21,10.16 10.16,10.16 10.16,14.22 49.78,10.16 40.64,10.16 86.36,10.16 83.31,10.16 16.26,17.27 16.26,20.32 19.3,17.27 19.3,20.32 19.3,23.37 19.3,26.42 16.26,26.42 16.26,29.46 19.3,29.46 80.26,22.35 80.26,25.4 77.22,25.4 77.22,28.45 74.17,28.45 71.12,28.45 77.22,19.3 77.22,22.35 22.35,26.42 25.4,26.42 31.5,26.42 34.54,26.42 40.64,26.42 52.58,26.29 58.04,26.42 8.13,50.16 11.18,50.16 14.22,50.16 17.27,50.16 20.32,50.16 23.37,50.16 26.42,50.16 29.46,50.16 32.51,50.16 35.56,50.16 38.61,50.16 58.93,50.16 61.98,50.16 65.02,50.16 68.07,50.16 71.12,50.16 74.17,50.16 77.22,50.16 80.26,50.16 83.31,50.16 86.36,50.16 89.41,50.16 93.47,49.78 96.52,49.78 96.52,46.74 93.47,46.74 96.52,43.69 93.47,43.69 96.52,40.64 96.52,34.54 96.52,31.5 93.47,34.54 90.42,40.64 88.39,34.54 60.45,36.07 63.5,36.07 41.66,25.15 32.38,34.8 64.26,25.91
  pour Top (rank 2): -1.27,51.44 -1.27,-0.13 99.06,-0.13 99.06,51.44
  pour Bottom: -2.54,52.7 -2.54,-0.64 100.33,-0.64 100.33,52.7
  pour Route15: -5.08,55.88 -5.08,-2.16 102.87,-2.16 102.87,55.88
  pour Route2: -3.81,54.61 -3.81,-1.27 101.6,-1.27 101.6,54.61
INVERTER_24V_EN  (via drill 0.35)
  Route2 0.254: J7.8 32.89,45.75 32.89,43.18 42.93,33.15 42.93,31.75 43.56,31.11 45.09,31.11 45.72,30.48 45.72,28.07 v41.66,24
  Bottom 0.254: v41.66,24 41.66,23 40.88,22.23 D1.3 Q1.1 40.42,19.61 R5.2
INVERTER_24V_EN_BOOSTED
  Bottom 0.254: J1.15 45.66,27.73 38.4,27.73 33.9,23.23 Q2.3
INVERTER_EN  (via drill 0.35)
  Route2 0.254: J7.6 34.92,45.72 34.92,43.05 43.43,34.54 44.83,34.54 45.72,33.66 45.72,31.62 46.48,30.86 47.88,30.86 48.83,29.91 48.83,27.24 49.66,26.42 50.93,26.42 v51.44,25.91
  Bottom 0.254: 53.25,19.48 Q3.1 D3.3 51.8,25.54 v51.44,25.91
  Bottom 0.508: 53.25,19.48 R8.2
INVERTER_EN_BOOSTED
  Bottom 0.254: Q4.3 45.83,23.5 50.27,27.93 J1.16
LATCH_BTN
  Route2 0.508: J7.13 J7.14 25.93,47.35 27.08,48.51 46.51,48.51 57.78,37.24 57.78,30.85 J1.18
N$1
  Route2 0.254: ACCEL1.1 12.7,38.23 12.7,45.59 15.26,48.15 22.05,48.15 22.97,47.23 22.97,45.67 J7.15
N$2
  Route2 0.254: J7.16 23.93,47.35 22.26,49.02 14.86,49.02 11.05,45.21 ACCEL2.1
N$3
  Route2 0.254: J7.17 21.93,41.74 BRAKE2.1
N$4
  Route2 0.254: J7.18 21.93,46.28 21.01,45.36 21.01,42.22 19.18,40.39 BRAKE1.1
N$5
  Bottom 0.254: R6.2 35.27,19.36 D2.1 33.66,19.36 31.98,21.03 Q2.1 31.8,21.12 R7.1
N$7
  Bottom 0.254: R6.1 36.12,17.82 Q1.3
N$8
  Bottom 0.254: Q4.1 45.5,19.61 D4.1 45.96,19.48 48.1,19.48 R9.2 R10.1
N$9
  Bottom 0.254: R9.1 48.86,18.54 Q3.3
N$11
  Bottom 0.254: Q6.1 55.9,20.99 R11.1 D5.1 58,19.48 Q5.3
OKHS_IN
  Route2 0.254: J1.13 40.01,30.6 37.6,30.6 36.83,31.37 36.83,33.02 36.2,33.66 32,33.66 30.3,35.36 30.3,44.34 J7.9
REFERENCE_EXT
  Route2 0.254: J7.12 26.92,45.72 26.92,41.02 27.56,40.39 27.56,35.31 33.53,29.34 J1.11
SHDN_A
  Top 0.508: XF1.3 XF1.4 31.51,41.67 27.94,38.1 27.94,33.96 27.3,33.33 J5.1 J5.2
  pour Top (no thermals): 40.39,49.53 40.39,40.01 46.61,40.01 46.61,49.53
SHDN_B
  Top 0.508: J7.24 J7.23 15.93,44.34 23.27,37 J5.4 | J5.4 J5.3 | J5.4 21.59,34.65 21.59,29.21 23.26,27.54 27.07,27.54 35,19.61 55.17,19.61 60.33,14.46 84.81,14.46 89.73,19.38 J12.5
SHDN_G  (via drill 0.65)
  Top 0.508: J7.2 J7.1 | v48.26,44.7 48.26,40.64 50.16,38.73 87.38,38.73 95.89,30.23 95.89,17.73 J2.5
  Route15 0.508: v48.26,44.7 46.24,46.72 J7.2
SHDN_H
  Top 0.508: J3.8 59.64,9.53 79.6,9.53 J2.6
SHDN_I
  Top 0.508: J3.6 61.28,5.17 49.03,5.17 J8.1 J8.2
SHDN_J  (via drill 0.65)
  Top 0.508: J9.2 33.02,3.99 | 33.02,3.99 J9.1 41.86,3.99 J8.4 J8.3 48.49,6.35 54.2,6.35 59.28,11.43 88.14,11.43 94.61,17.91 94.61,22.73 93.53,23.81 88.23,23.81 J12.2 | v29.21,17.14 28.45,16.38 28.45,6.48 31.11,3.81 32.84,3.81 33.02,3.99
  Route15 0.508: J7.5 33.92,40.27 29.84,36.2 29.84,17.78 v29.21,17.14
SHDN_K
  Top 0.508: J9.4 J9.3 42.01,13.21 85.9,13.21 91.44,18.75 91.44,20.73 J12.6
  Route2 0.508: J9.3 35.79,7.62 43.05,14.88 46.63,14.88 54.74,22.99 54.74,30.87 J1.7 J1.8
STEERING_1_EXT
  Route15 0.254: J7.19 19.93,40.73 19.19,39.99 19.19,33.92 15.86,30.6 7.88,30.6 6.57,29.28 6.57,27.81 7.44,26.94 8.37,26.94 8.93,26.38 8.93,23.56 J14.7
STEERING_2_EXT
  Route15 0.254: J14.6 5.08,28.04 5.08,31.11 6.41,32.45 16.57,32.45 18.54,34.42 18.54,40.51 19.01,40.98 19.01,45.68 19.93,46.6 J7.20
STEERING_RX_N
  Route15 0.254: J6.14 70.61,45.72 70.61,43.35 67.44,40.18 67.44,19.35 62.29,14.2 20,14.2 17.53,16.68 17.53,21.84 15.24,24.13 10.16,24.13 9.53,24.77 9.53,26.67 7.82,28.37 J14.5
STEERING_RX_P
  Route15 0.254: J6.13 70.1,44.23 70.1,43.56 66.93,40.39 66.93,19.56 62.08,14.71 20.21,14.71 18.03,16.89 18.03,22.05 14.71,25.38 J14.2
STEERING_TX_N
  Route15 0.254: J6.10 74.68,45.65 74.68,43.35 73.23,41.91 70.99,41.91 69.22,40.13 69.22,18.97 63.08,12.83 16.3,12.83 12.06,17.06 12.06,18.06 J14.4
STEERING_TX_P
  Route15 0.254: J6.9 74.17,44.16 74.17,43.56 73.03,42.42 70.78,42.42 68.71,40.34 68.71,19.18 62.87,13.34 16.51,13.34 12.7,17.14 12.7,20.42 J14.3
THERM_FL_EXT  (via drill 0.35)
  Top 0.254: J13.2 71.35,19.07 67.82,22.61 67.82,25.78 66.67,26.92 v64.77,26.92
  Route2 0.254: J7.3 35.92,43.7 44.06,35.56 v52.7,35.56
  Route15 0.254: v64.77,26.92 59.69,26.92 57.78,28.83 57.78,33.02 55.24,35.56 v52.7,35.56
THERM_FR_EXT
  Bottom 0.254: J7.4 34.92,45.73 34.92,35.94 28.32,29.34 28.32,25.25 J4.2

### Text on the board
tPlace: FIREWALL | BOTS | STEERING | DASH | Connector Board Rev2 | FR THERM | FL THERM | Designed by | Siddharth Lohani | Eric Galluzzi | & Cecilia Yang | APPS/BRAKES | BRB | INERTIA | FR CORNER | FL CORNER